# Altium schematic sheet RF Front End.SchDoc
size B; SheetNumber: 3; SheetTotal: 6
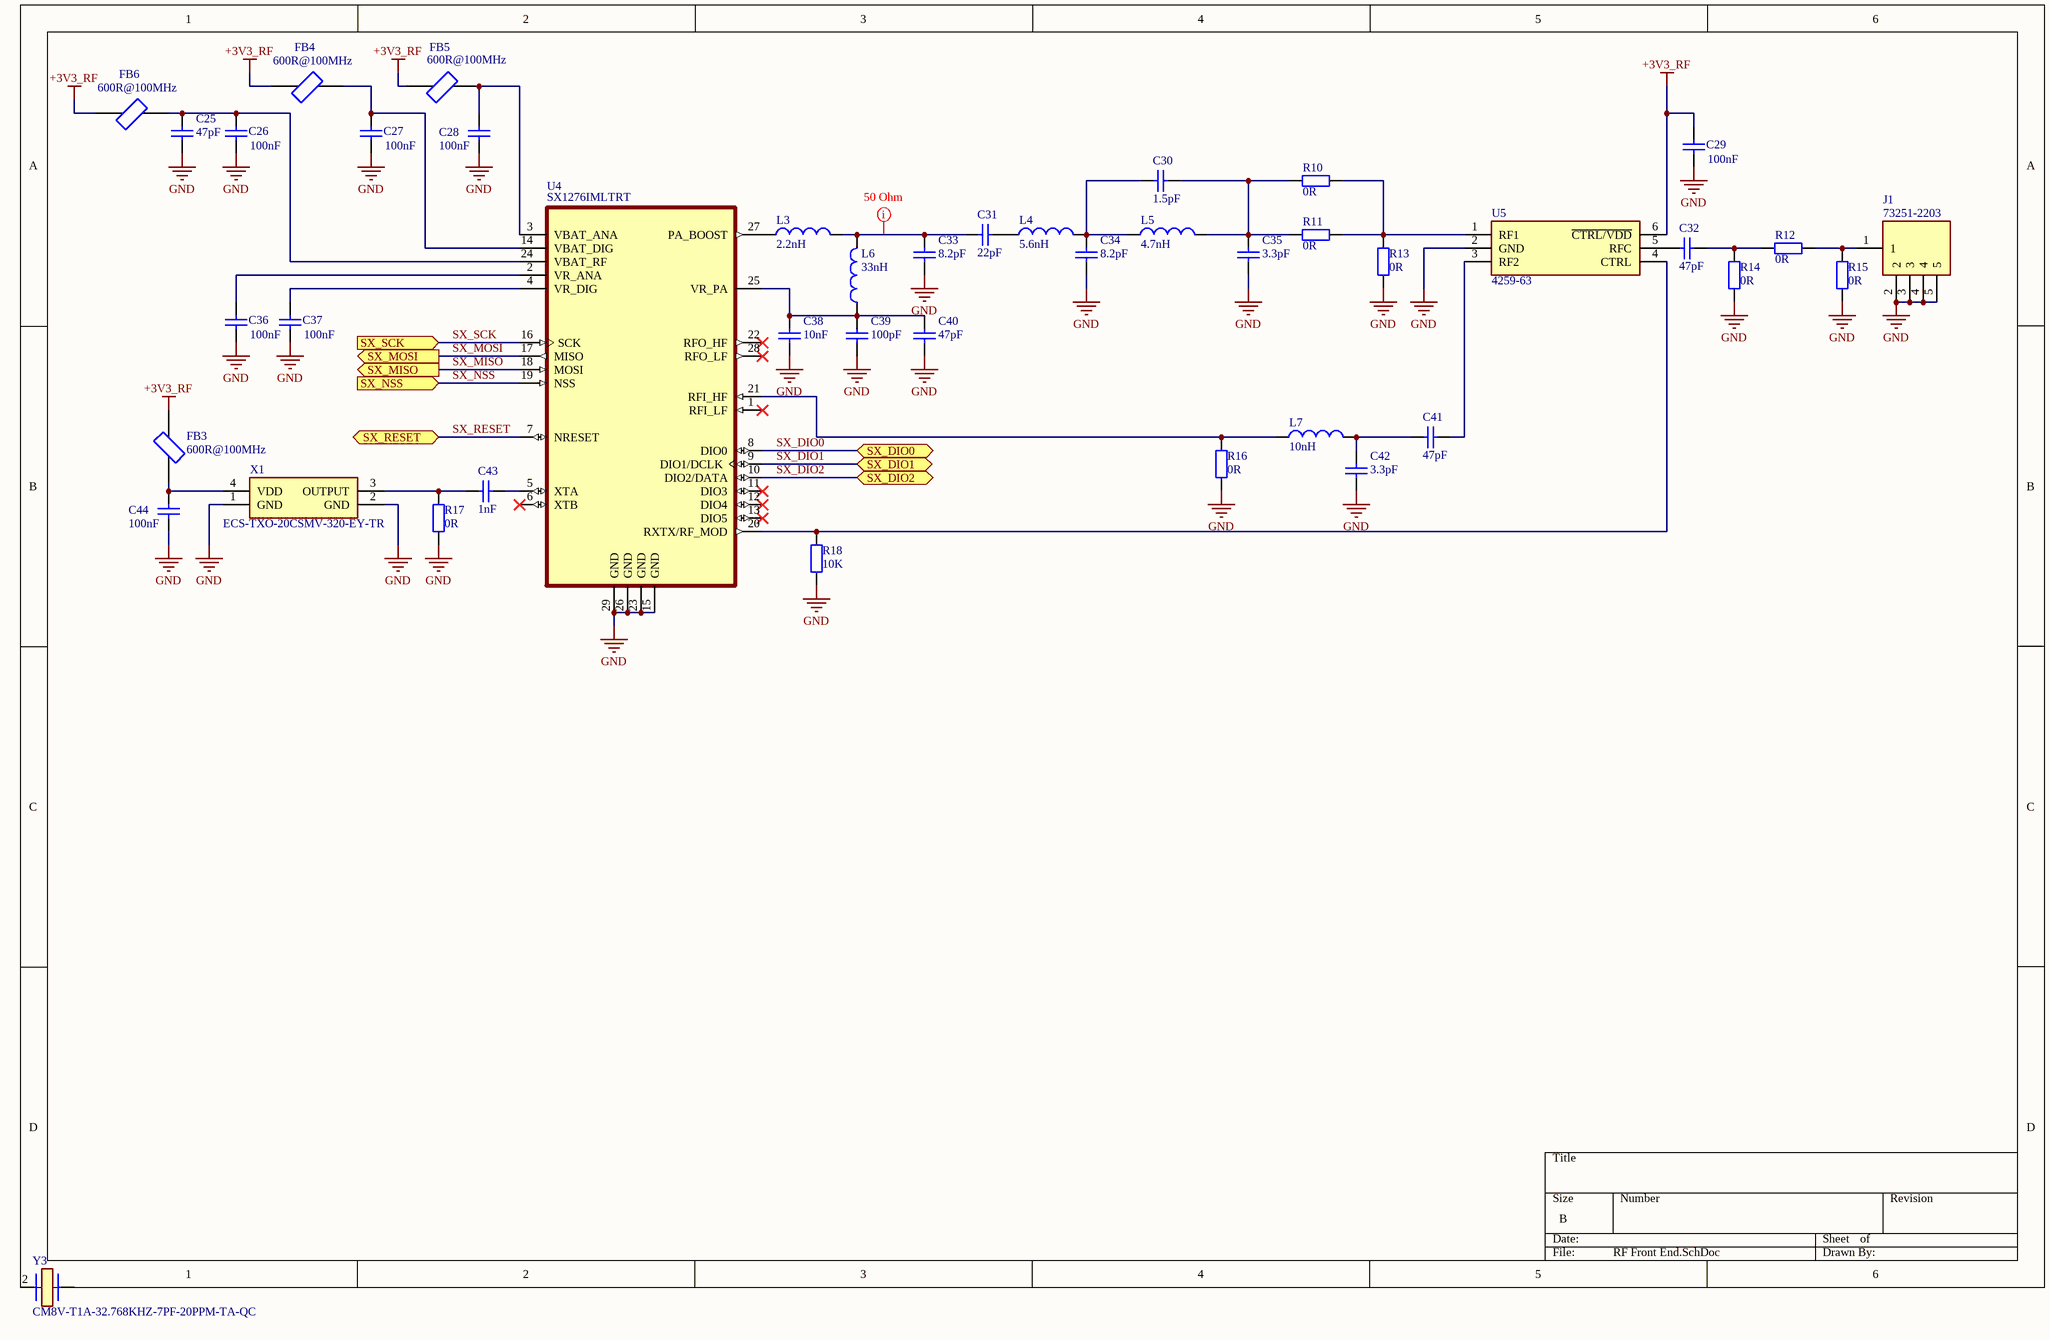
[diagram p0: RF Front End.SchDoc]

## Parts
C25  value 47pF  [0402]  (hidden comment: Cap)
C26  100nF  [0402]
C27  100nF  [0402]
C28  100nF  [0402]
C29  100nF  [0402]
C30  value 1.5pF  [0402]  (hidden comment: Cap)
C31  value 22pF  [0402]  (hidden comment: Cap)
C32  value 47pF  [0402]  (hidden comment: Cap)
C33  value 8.2pF  [0402]  (hidden comment: Cap)
C34  value 8.2pF  [0402]  (hidden comment: Cap)
C35  value 3.3pF  [0402]  (hidden comment: Cap)
C36  100nF  [0402]
C37  100nF  [0402]
C38  value 10nF  [0402]  (hidden comment: Cap)
C39  value 100pF  [0402]  (hidden comment: Cap)
C40  value 47pF  [0402]  (hidden comment: Cap)
C41  value 47pF  [0402]  (hidden comment: Cap)
C42  value 3.3pF  [0402]  (hidden comment: Cap)
C43  1nF  [0402]
C44  100nF  [0402]
FB3  600R@100MHz  [0402 Ferrite Bead]
FB4  600R@100MHz  [0402 Ferrite Bead]
FB5  600R@100MHz  [0402 Ferrite Bead]
FB6  600R@100MHz  [0402 Ferrite Bead]
J1  73251-2203  [732512203]
L3  value 2.2nH  [0402-A]  (hidden comment: Inductor)
L4  value 5.6nH  [0402-A]  (hidden comment: Inductor)
L5  value 4.7nH  [0402-A]  (hidden comment: Inductor)
L6  value 33nH  [0402-A]  (hidden comment: Inductor)
L7  value 10nH  [0402-A]  (hidden comment: Inductor)
R10  0R  [SMD-0402-RES]
R11  0R  [SMD-0402-RES]
R12  0R  [SMD-0402-RES]
R13  0R  [SMD-0402-RES]
R14  0R  [SMD-0402-RES]
R15  0R  [SMD-0402-RES]
R16  0R  [SMD-0402-RES]
R17  0R  [SMD-0402-RES]
R18  10K  [SMD-0402-RES]
U4  SX1276IMLTRT  [SX1276IMLTRT]
U5  4259-63  [4259-63]
X1  ECS-TXO-20CSMV-320-EY-TR  [ECS-TXO-20CSMV-320-EY-TR]
Y3  CM8V-T1A-32.768KHZ-7PF-20PPM-TA-QC  [CM8V32768TA020125]

## Ports
SX_DIO0 (bidir, see MCU[1B]), SX_DIO1 (bidir, see MCU[1B]), SX_DIO2 (bidir, see MCU[1B]), SX_MISO (out, see MCU[1C]), SX_MOSI (out, see MCU[1C]), SX_NSS (in, see MCU[1B]), SX_RESET (bidir, see MCU[1B]), SX_SCK (in, see MCU[1B])

## Nets
+3V3_RF: C29.2 FB3.2 FB4.1 FB5.1 FB6.1 U5.6(~{CTRL/}~{VDD})
GND: C25.1 C26.1 C27.1 C28.1 C29.1 C33.1 C34.1 C35.1 C36.1 C37.1 C38.1 C39.1 C40.1 C42.1 C44.1 J1.2 J1.3 J1.4 J1.5 R13.1 R14.1 R15.1 R16.1 R17.1 R18.1 U4.15(GND) U4.23(GND) U4.26(GND) U4.29(GND) U5.2(GND) X1.1(GND) X1.2(GND)
SX_DIO0: U4.8(DIO0) ; port SX_DIO0
SX_DIO1: U4.9(DIO1/DCLK) ; port SX_DIO1
SX_DIO2: U4.10(DIO2/DATA) ; port SX_DIO2
SX_MISO: U4.18(MOSI) ; port SX_MISO
SX_MOSI: U4.17(MISO) ; port SX_MOSI
SX_NSS: U4.19(NSS) ; port SX_NSS
SX_RESET: U4.7(NRESET) ; port SX_RESET
SX_SCK: U4.16(SCK) ; port SX_SCK
NetC25_2: C25.2 C26.2 FB6.2 U4.24(VBAT_RF)
NetC27_2: C27.2 FB4.2 U4.14(VBAT_DIG)
NetC28_2: C28.2 FB5.2 U4.3(VBAT_ANA)
NetC30_1: C30.1 C35.2 L5.2 R10.1 R11.1
NetC30_2: C30.2 C34.2 L4.2 L5.1
NetC31_1: C31.1 L4.1
NetC31_2: C31.2 C33.2 L3.2 L6.2
NetC32_1: C32.1 R12.2 R14.2
NetC32_2: C32.2 U5.5(RFC)
NetC36_2: C36.2 U4.2(VR_ANA)
NetC37_2: C37.2 U4.4(VR_DIG)
NetC38_2: C38.2 C39.2 C40.2 L6.1 U4.25(VR_PA)
NetC41_1: C41.1 U5.3(RF2)
NetC41_2: C41.2 C42.2 L7.2
NetC43_1: C43.1 U4.5(XTA)
NetC43_2: C43.2 R17.2 X1.3(OUTPUT)
NetC44_2: C44.2 FB3.1 X1.4(VDD)
NetJ1_1: J1.1 R12.1 R15.2
NetL3_1: L3.1 U4.27(PA_BOOST)
NetL7_1: L7.1 R16.2 U4.21(RFI_HF)
NetR10_2: R10.2 R11.2 R13.2 U5.1(RF1)
NetR18_2: R18.2 U4.20(RXTX/RF_MOD) U5.4(CTRL)

Not connected (* = marked no-connect by the designer): U4 1(RFI_LF)* 6(XTB)* 11(DIO3)* 12(DIO4)* 13(DIO5)* 22(RFO_HF)* 28(RFO_LF)*; Y3 2(X2) ?1

## Layout directives
mark named 50 Ohm: NetC31_2

## Library data of the parts
C25-C44 = Cap: Capacitor; Published: 8-Jun-2000; LatestRevisionDate: 17-Jul-2002; LatestRevisionNote: Re-released for DXP Platform.; PackageReference: RAD-0.3; Publisher: Altium Limited; PackageDescription: Radial Cap, Thru-Hole; 2 Leads; 0.3 in Pin Spacing
FB3-FB6 = Ferrite: Ferrite Beads FERRITE BEAD 600 OHM 0603 1LN; MF: Laird-Signal Integrity Products; MP: MI0805K400R-10; SnapEDA_Link: https://www.snapeda.com/parts/MI0805K400R-10/Laird-Signal+Integrity+Products/view-part/?ref=snap; Package: 0805 Laird; Value: *; Check_prices: https://www.snapeda.com/parts/MI0805K400R-10/Laird-Signal+Integrity+Products/view-part/?ref=eda
J1 = 73251-2203: RF Connectors / Coaxial Connectors Conn 50 Ohms, SMA Jack, Right-Angle PCB, Gold; Manufacturer_Name: Molex; Geometry.Height: 10.59mm; Mouser Part Number: 538-73251-2203; Mouser Price/Stock: https://www.mouser.co.uk/ProductDetail/Molex/73251-2203?qs=KpdAywxU013Bis55GeNoeg%3D%3D; Manufacturer_Part_Number: 73251-2203; Datasheet Link: https://www.molex.com/en-us/products/part-detail-pdf/732512203?display=pdf
L3-L7 = Inductor: Code_IEC: 1005; Published: 8-Jun-2000; LatestRevisionDate: 29-May-2009; LatestRevisionNote: IPC-7351 Footprint Added.; PackageReference: 0402-A; Publisher: Altium Limited; PackageDescription: Chip Inductor; Code_JEITA: 0402
R10-R18 = Res2: Resistor; Published: 8-Jun-2000; LatestRevisionDate: 17-Jul-2002; LatestRevisionNote: Re-released for DXP Platform.; PackageReference: AXIAL-0.4; Publisher: Altium Limited; PackageDescription: Axial Device, Thru-Hole; 2 Leads; 0.4 in Pin Spacing
  R10-R17: Value: 0R
  R18: Value: 10K
U4 = SX1276IMLTRT: IC RF TxRx Only 802.15.4 LoRaâ„¢ 137MHz ~ 1.02GHz 28-VQFN Exposed Pad; MF: Semtech Corporation; SnapEDA_Link: https://www.snapeda.com/parts/SX1276IMLTRT/Semtech+Corporation/view-part/?ref=snap; Package: VQFN-28 Semtech; Value: *; MP: SX1276IMLTRT; Check_prices: https://www.snapeda.com/parts/SX1276IMLTRT/Semtech+Corporation/view-part/?ref=eda
U5 = 4259-63: RF switch IC; Manufacturer_Name: Peregrine Semiconductor; Geometry.Height: 1.1mm; Mouser Part Number: 81-4259-63; Mouser Price/Stock: https://www.mouser.co.uk/ProductDetail/pSemi/4259-63?qs=iw0hurA%2FaD37qvQcKdATTw%3D%3D; Manufacturer_Part_Number: 4259-63; Datasheet Link: http://www.psemi.com/pdf/datasheets/pe4259ds.pdf
X1 = ECS-TXO-20CSMV-320-EY-TR: TCXO Oscillators MultiVolt TCXO,32MHz,+/-2.5ppm,1.7V 3.465V,2.5 mA,-30 C 85 C, 2.00mm x 1.60mm; Manufacturer_Name: ECS; Geometry.Height: 0.8mm; Mouser Part Number: 520-TXO20CSMV320EYTR; Mouser Price/Stock: https://www.mouser.co.uk/ProductDetail/ECS/ECS-TXO-20CSMV-320-EY-TR?qs=7MVldsJ5UazLDC0xk68SAQ%3D%3D; Manufacturer_Part_Number: ECS-TXO-20CSMV-320-EY-TR; Datasheet Link: https://ecsxtal.com/store/pdf/ECS-TXO-20CSMV.pdf
Y3 = CM8V-T1A-32.768KHZ-7PF-20PPM-TA-QC: Crystal or Oscillator; Manufacturer_Name: Micro Crystal AG; Datasheet Link: https://www.microcrystal.com/fileadmin/Media/Products/32kHz/Datasheet/CM8V-T1A.pdf; Height: 0.6mm; Manufacturer_Part_Number: CM8V-T1A-32.768KHZ-7PF-20PPM-TA-QC; Mouser Part Number: 428-201436-MC01; Mouser Price/Stock: https://www.mouser.co.uk/ProductDetail/Micro-Crystal/CM8V-T1A-32.768kHz-7pF-20PPM-TA-QC?qs=7bTaA%2FLYtSYyZWzzv04BxA%3D%3D; Arrow Part Number: CM8V-T1A-32.768KHZ-7PF-20PPM-TA-QC; Arrow Price/Stock: https://www.arrow.com/en/products/cm8v-t1a-32.768khz-7pf-20ppm-ta-qc/micro-crystal-ag?utm_currency=USD&region=nac